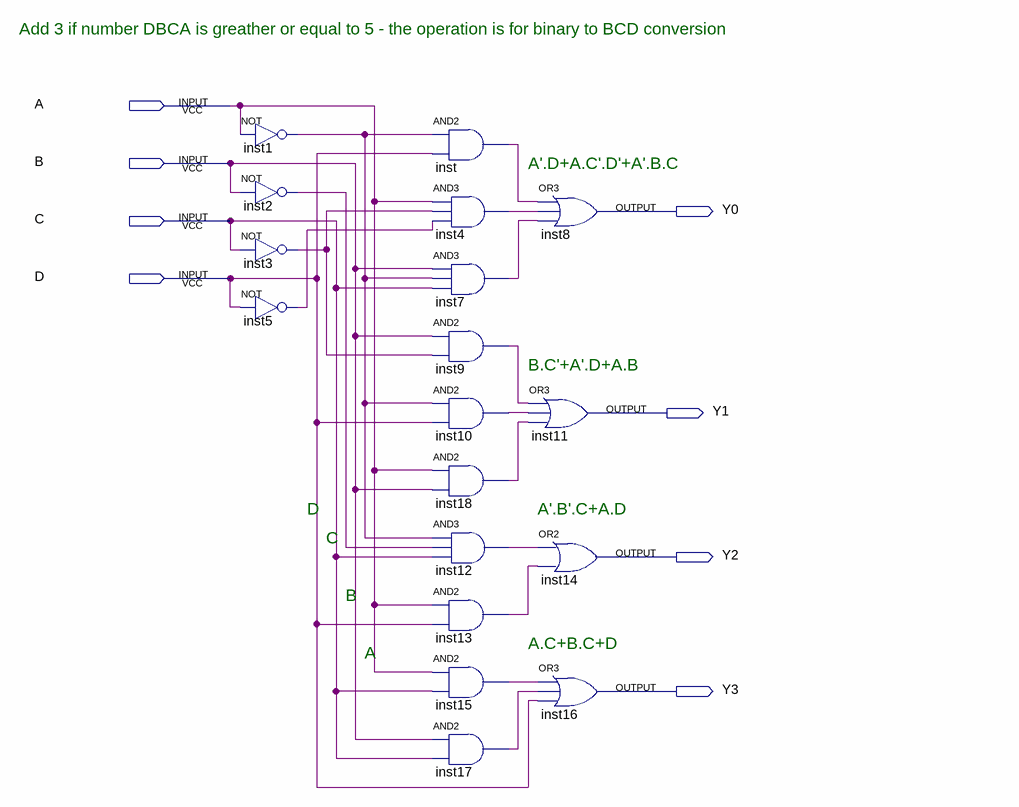
[diagram p0: schematic sheet]
// Quartus schematic xadjust.bdf as structural Verilog: 18 symbols, 8 pins
module xadjust (
  input  A,
  input  B,
  input  C,
  input  D,
  output Y0,
  output Y1,
  output Y2,
  output Y3
);

  wire inst1_out, inst2_out, inst3_out, inst4_out, inst5_out, inst7_out, inst9_out, inst10_out, inst12_out,
       inst13_out, inst15_out, inst17_out, inst18_out, inst_out;

  not inst1 (inst1_out, A);
  not inst2 (inst2_out, B);
  not inst3 (inst3_out, C);
  not inst5 (inst5_out, D);
  and inst (inst_out, inst1_out, D);
  and inst4 (inst4_out, A, inst3_out, inst5_out);
  and inst7 (inst7_out, B, inst1_out, C);
  and inst9 (inst9_out, B, inst3_out);
  and inst10 (inst10_out, inst1_out, D);
  and inst18 (inst18_out, A, B);
  and inst12 (inst12_out, inst1_out, inst2_out, C);
  and inst13 (inst13_out, A, D);
  and inst15 (inst15_out, A, C);
  and inst17 (inst17_out, B, C);
  or inst8 (Y0, inst_out, inst4_out, inst7_out);
  or inst11 (Y1, inst9_out, inst10_out, inst18_out);
  or inst14 (Y2, inst12_out, inst13_out);
  or inst16 (Y3, inst15_out, inst17_out, D);

  // Notes on the sheet:
  //   Add 3 if number DBCA is greather or equal to 5 - the operation is for binary to BCD conversion
  //   A'.D+A.C'.D'+A'.B.C
  //   B.C'+A'.D+A.B
  //   D
  //   A'.B'.C+A.D
  //   C
  //   B
  //   A.C+B.C+D
  //   A
endmodule
